# Altium project BalancerRobot.PrjPcb
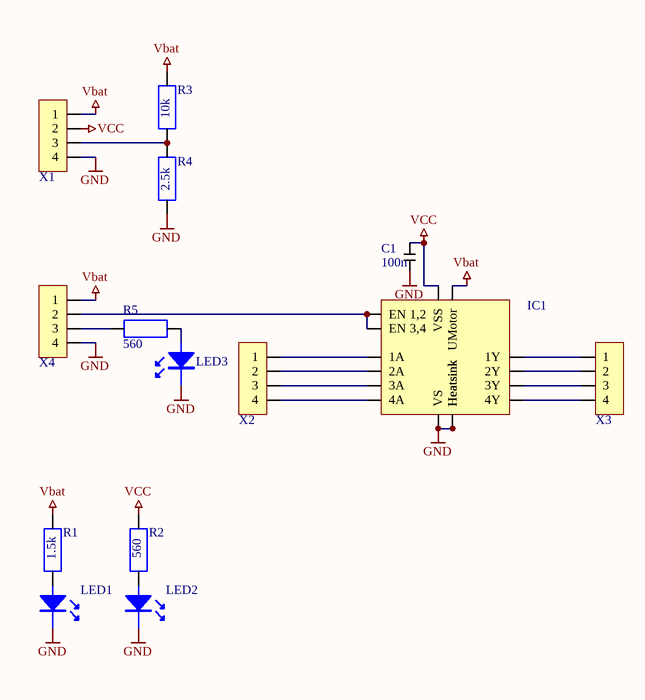
[diagram p0: Motor Driver.SchDoc]
1 sheet, 14 parts. Net scope: global (net labels, ports and power ports of the same name join across sheets).
Board file: Motor Driver.PcbDoc

## Sheet Motor Driver.SchDoc
size A4

### Parts
C1  100n  [0805_R]
IC1  L293D  [DIP16]  (value not drawn)
LED1  APT3216CGCK  [LED_3216_GREEN]  (value not drawn)
LED2  APT3216CGCK  [LED_3216_GREEN]  (value not drawn)
LED3  APT3216CGCK  [LED_3216_GREEN]  (value not drawn)
R1  Comment_1: 1.5k  [0805_R]  (hidden comment: Chip Resistor 10k, 0805, 1%)
R2  Comment_1: 560  [0805_R]  (hidden comment: Chip Resistor 10k, 0805, 1%)
R3  Comment_1: 10k  [0805_R]  (hidden comment: Chip Resistor 10k, 0805, 1%)
R4  Comment_1: 2.5k  [0805_R]  (hidden comment: Chip Resistor 10k, 0805, 1%)
R5  Comment_1: 560  [0805_R]  (hidden comment: Chip Resistor 10k, 0805, 1%)
X1  Pin Header 4x1 2.54mm  [PTSM 0,5 4-2,5-H SMD]  (value not drawn)
X2  Pin Header 4x1 2.54mm  [PTSM 0,5 4-2,5-H SMD]  (value not drawn)
X3  Pin Header 4x1 2.54mm  [PTSM 0,5 4-2,5-H SMD]  (value not drawn)
X4  Pin Header 4x1 2.54mm  [PTSM 0,5 4-2,5-H SMD]  (value not drawn)

### Nets
GND: C1.1 IC1.4(Heatsink) IC1.5(Heatsink) IC1.8(VS) IC1.12(Heatsink) IC1.13(Heatsink) LED1.K LED2.K LED3.K R4.1 X1.4 X4.4
Vbat: IC1.10(UMotor) R1.2 R3.2 X1.1 X4.1
VCC: C1.2 IC1.16(VSS) R2.2 X1.2
NetIC1_1: IC1.1(EN_1,2) IC1.9(EN_3,4) X4.2
NetIC1_2: IC1.2(1A) X2.1
NetIC1_3: IC1.3(1Y) X3.1
NetIC1_6: IC1.6(2Y) X3.2
NetIC1_7: IC1.7(2A) X2.2
NetIC1_10: IC1.10(3A) X2.3
NetIC1_11: IC1.11(3Y) X3.3
NetIC1_14: IC1.14(4Y) X3.4
NetIC1_15: IC1.15(4A) X2.4
NetLED1_A: LED1.A R1.1
NetLED2_A: LED2.A R2.1
NetLED3_A: LED3.A R5.2
NetR3_1: R3.1 R4.2 X1.3
NetR5_1: R5.1 X4.3

### Library data of the parts
C1 = Capacitor 0805: Ceramic Capacitor 0805
IC1 = L293D: Motor Driver, 1.2A Output
LED1-LED3 = LED: LED SMD green APT3216CGCK; Manufacturer: Kingbright; Part Number: 604-APT3216CGCK; Comment_1: APT-3216CGCK; Footprint: 1206; Notes: -; Price: 0.4; Supplier 1: Mouser; Supplier Part Number 1: APT3216CGCK
R1-R5 = RESISTOR: Resistor 10k 0.125W 0805; Manufacturer: Vishay; Part Number: CRCW080510K0FKEAC; Footprint: 0805; Supplier Part Number 1: 71-CRCW080510K0FKEAC; Price: 0.19; Supplier 1: Mouser
X1-X4 = PTSM 0,5/ 4-2,5-H SMD: PTSM 4 Pol; Manufacturer: Phoenix Contacdt; Part Number: 1814650; Supplier 1: Mouser; Supplier Part Number 1: 651-1814650; Price: 1.31